# Altium project Spectre-Spectrum-Analyer.PrjPcb
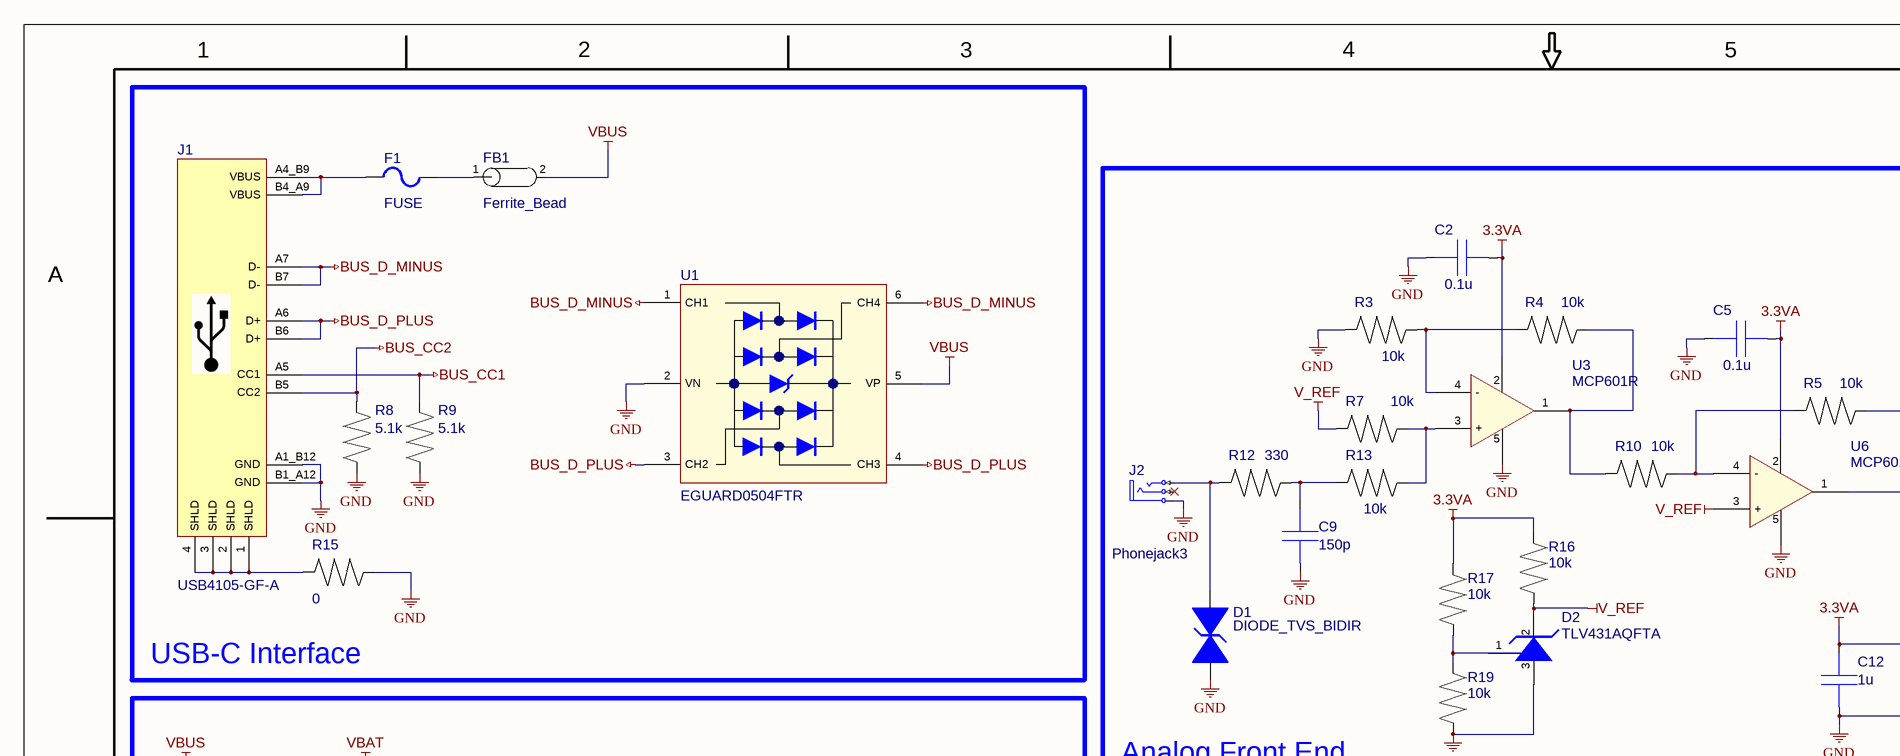
[diagram p0: Spectre-SCH_SH2_(rev).SchDoc, top left]
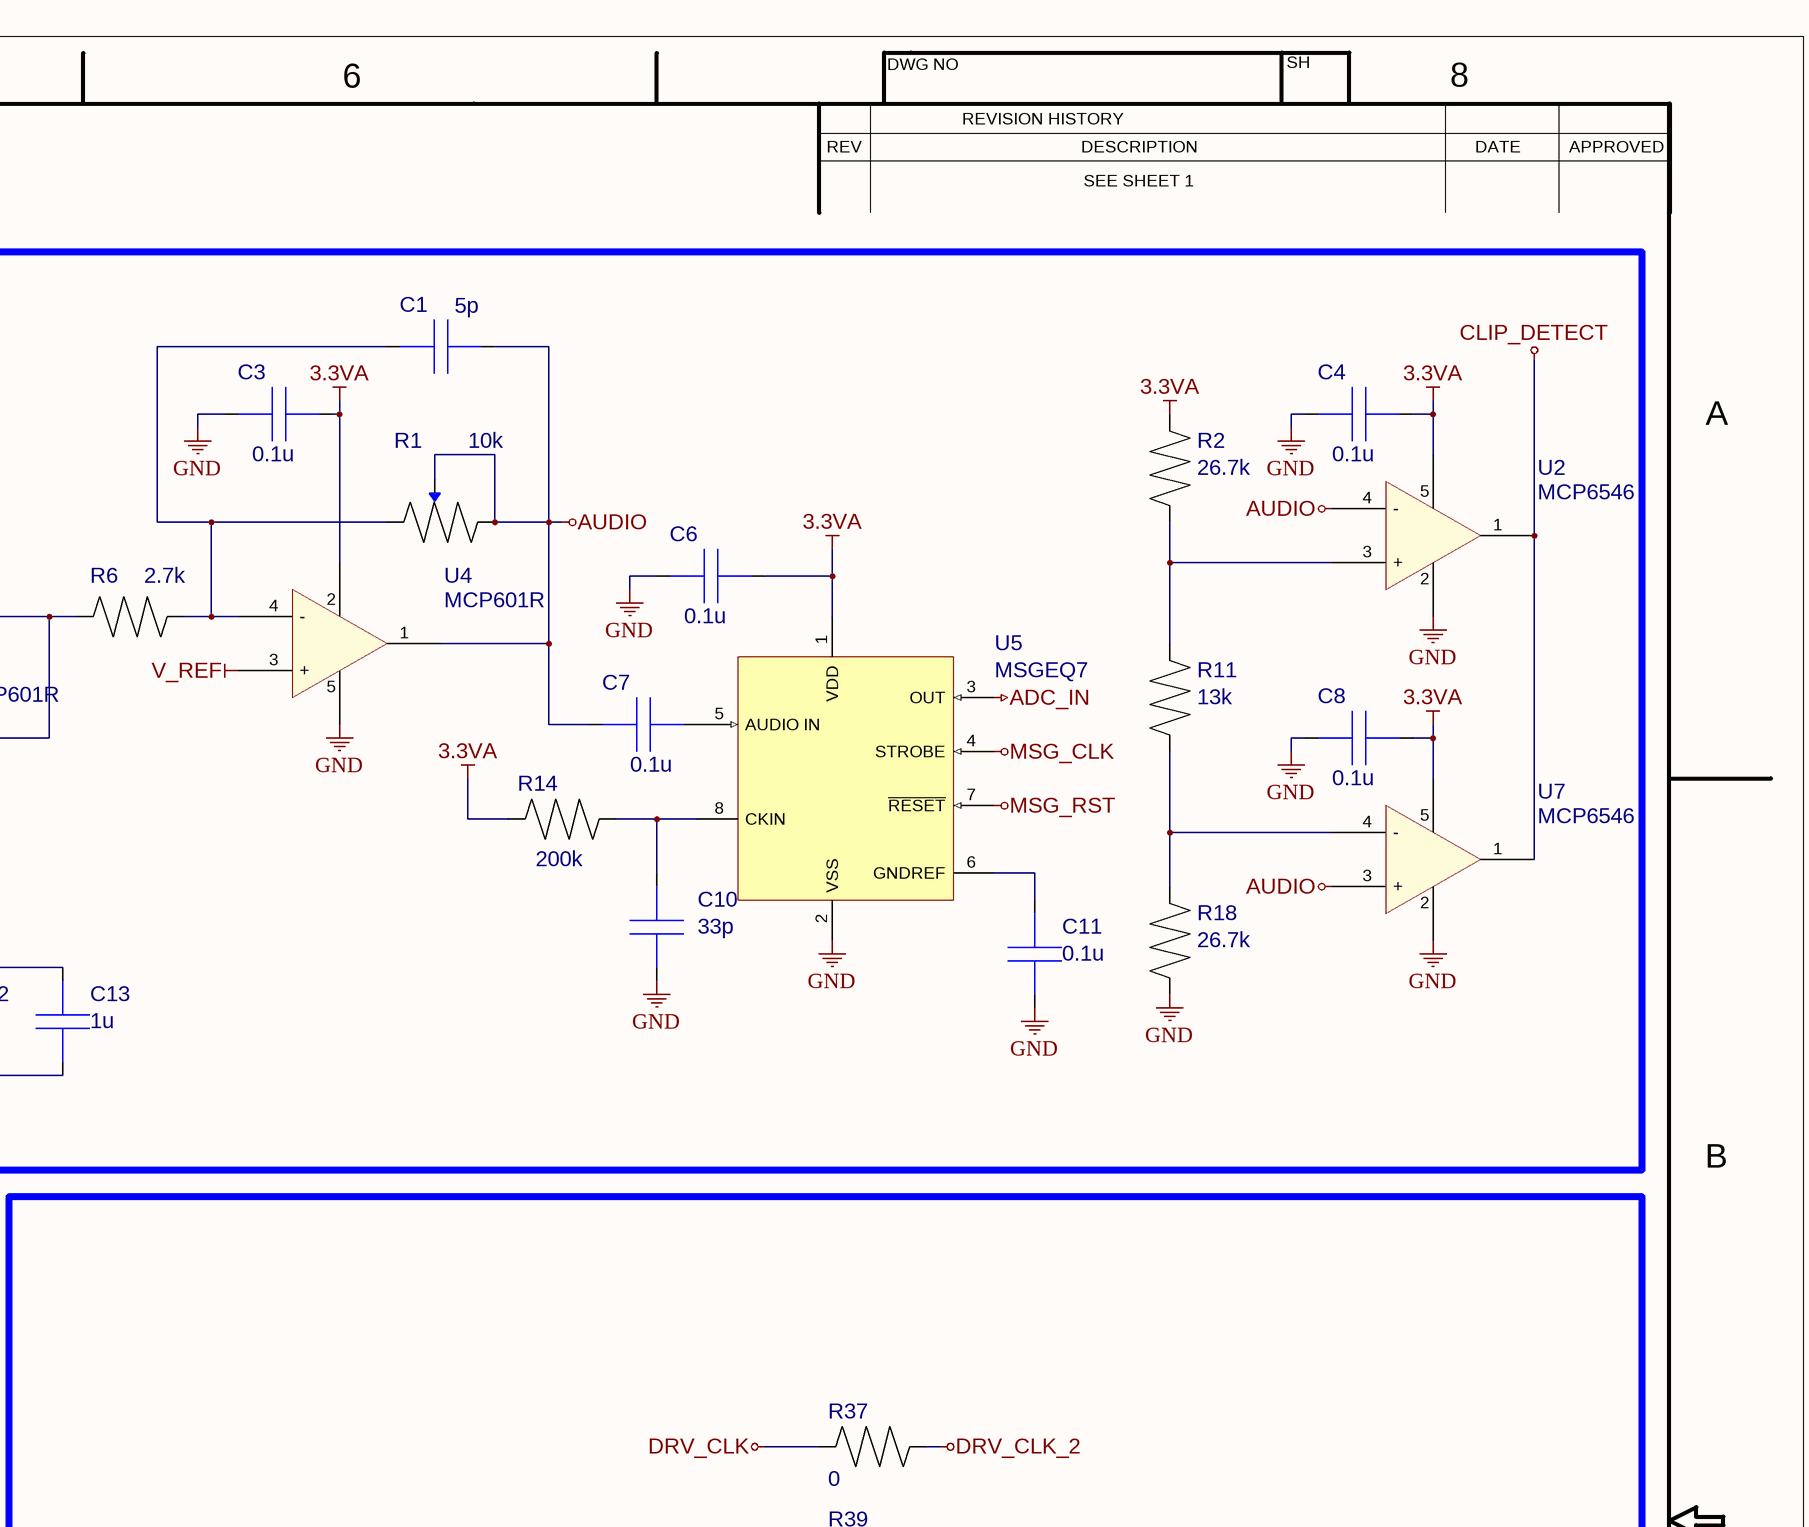
[diagram p1: Spectre-SCH_SH2_(rev).SchDoc, top right]
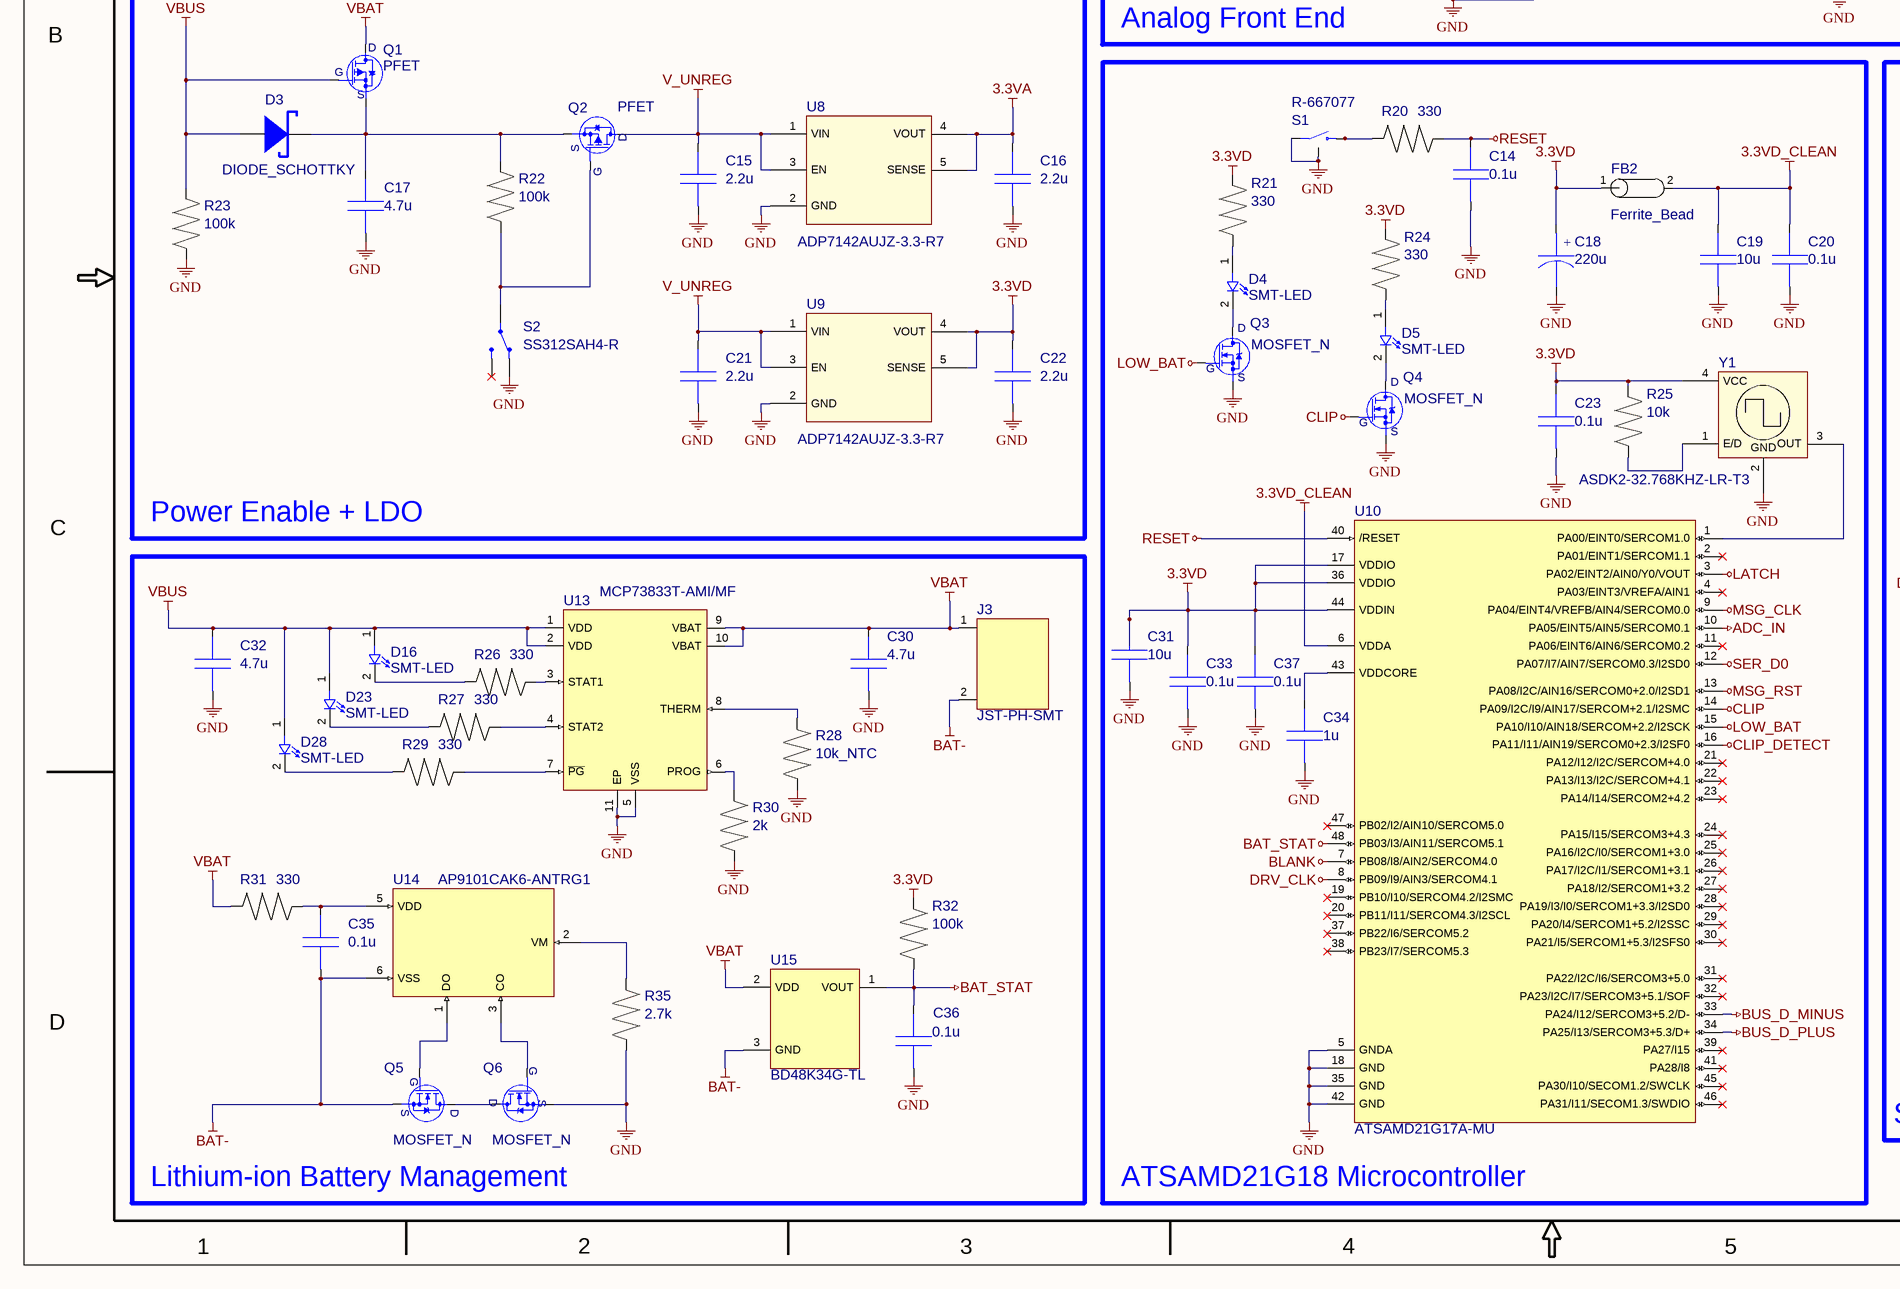
[diagram p2: Spectre-SCH_SH2_(rev).SchDoc, bottom left]
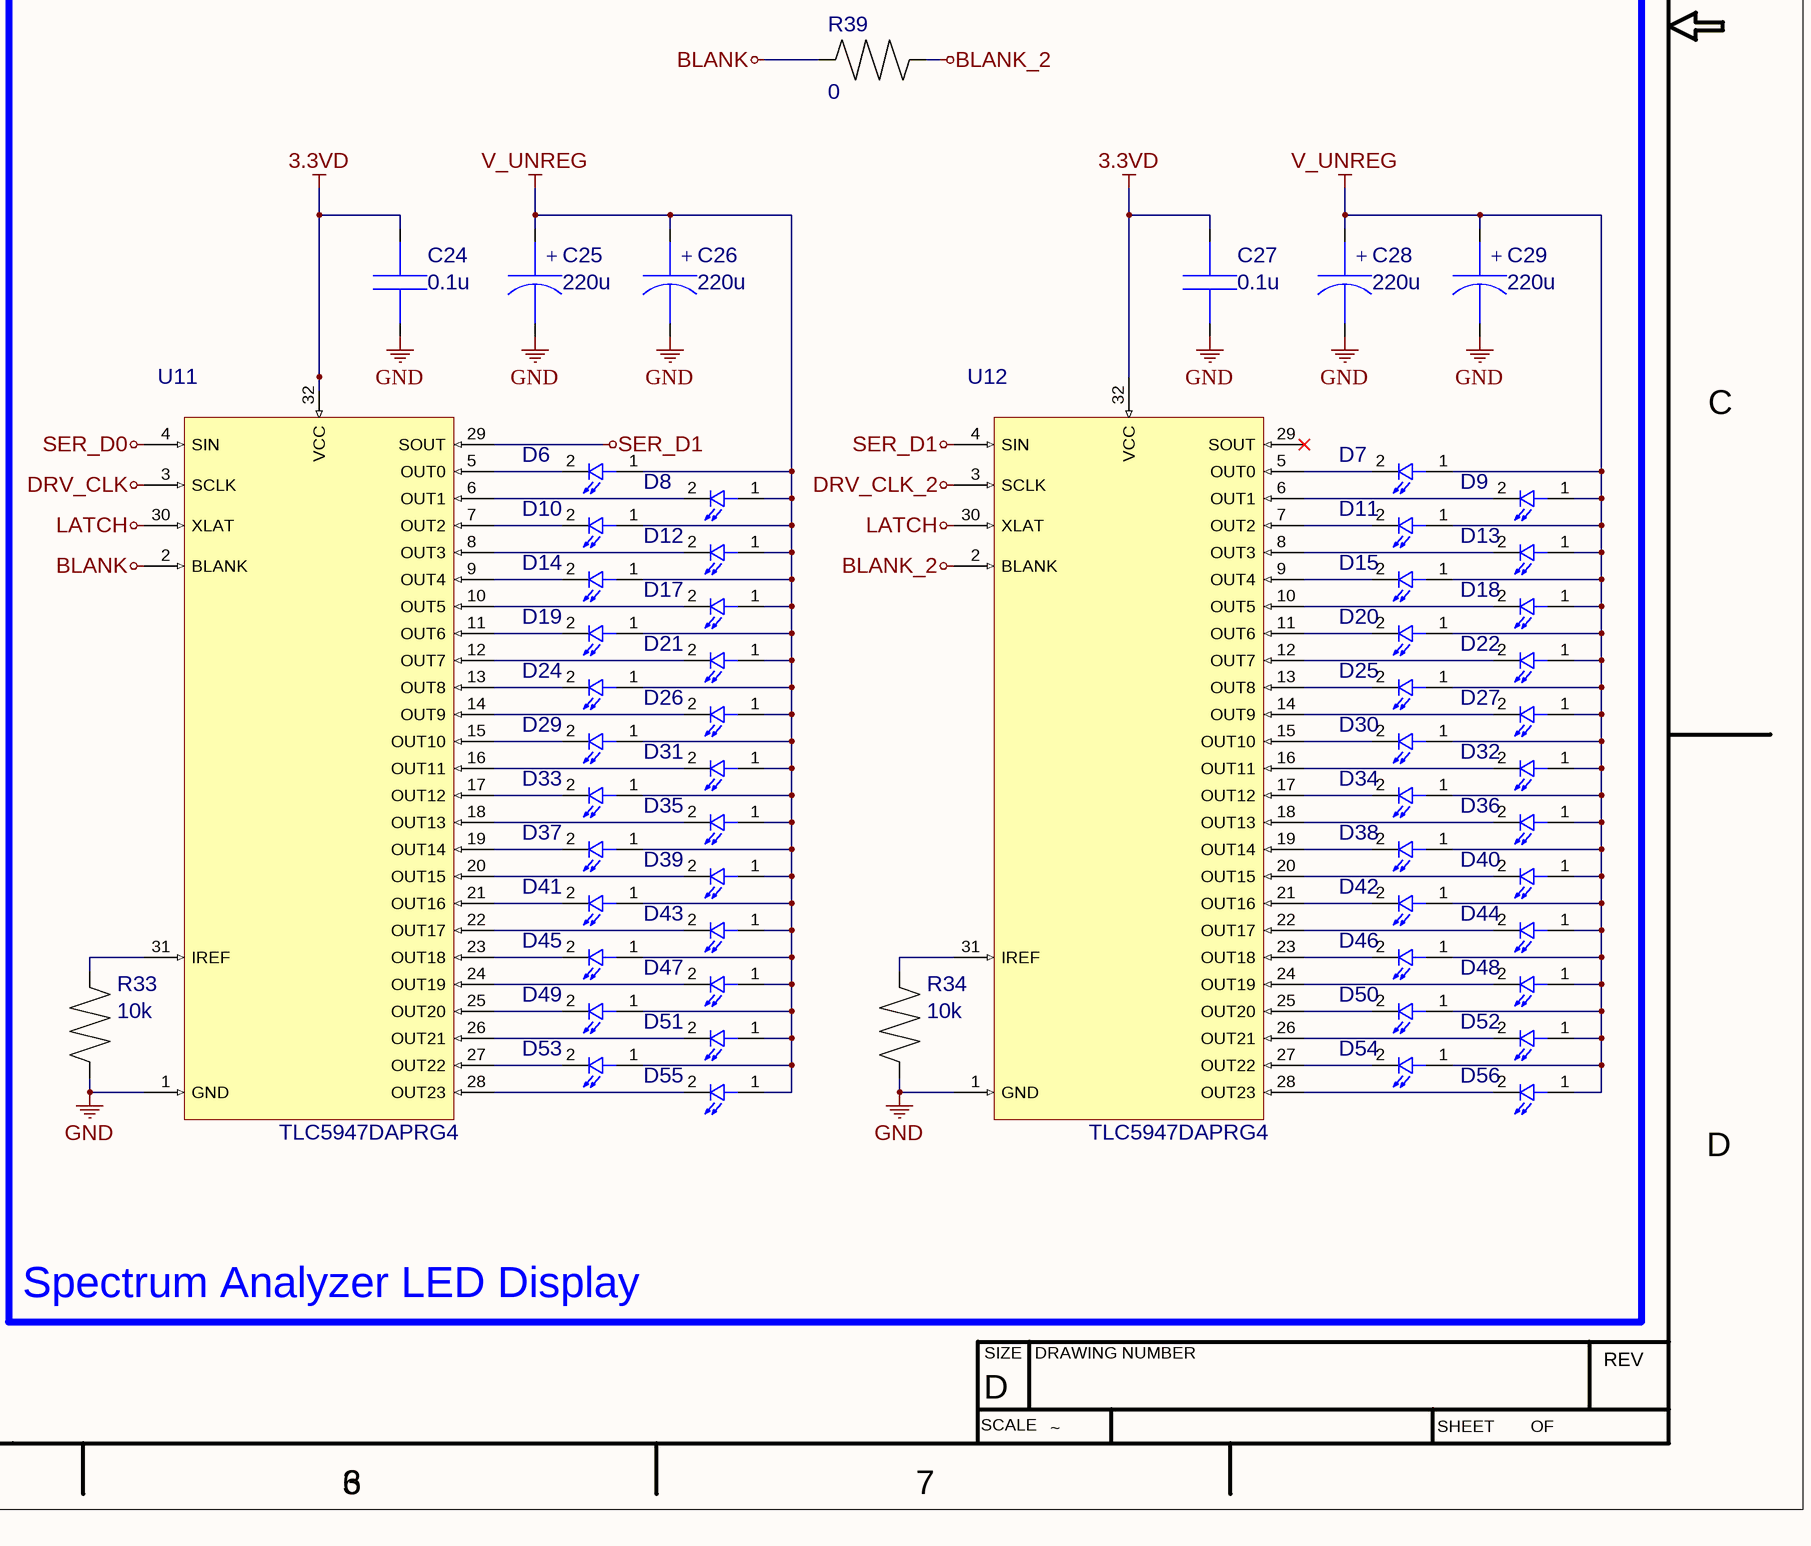
[diagram p3: Spectre-SCH_SH2_(rev).SchDoc, bottom right]
Company: OCEAN INSIGHT; DateDftg: -; DateEng: 09/10/21; DocNumber: Spectre; DocNumberPCB: SpectrePCB; Hist1Appr: -; Hist1Date: -; Hist1Desc: -; Hist1Rev: -; Hist2Appr: -; Hist2Date: -; Hist2Desc: -; Hist2Rev: -; Hist3Appr: -; Hist3Date: -; Hist3Desc: -; Hist3Rev: -; NameDftg: K. KIDD; NameEng: K. KIDD; Rev: A; Title0: Spectre; Title1: Audio Spectrum Analyzer; TitleCCA: CIRCUIT CARD ASSEMBLY,; TitlePCB: PRINTED CIRCUIT BOARD,; TitleSCH: SCHEMATIC, CCA,
1 sheet, 160 parts. Net scope: global (net labels, ports and power ports of the same name join across sheets).
Board file: Spectre.PcbDoc

## Sheet Spectre-SCH_SH2_(rev).SchDoc: SCHEMATIC
size 863 x 558 mm; DocumentNumber: XXX-20XXX-XXX; SheetNumber: 2; SheetTotal: 2; PageSetup: Record=PageOptions|CenterHorizontal=True|CenterVertical=True|PrintScale=0.98|XCorrection=1.00|YCorrection=1.00|PrintKind=2|BorderSize=5000000|LeftOffset=0|BottomOffset=0|Orientation=2|PaperLength=1000|PaperWidth=1000|Scale=100|PaperSource=15|PrintQuality=1200|MediaType=1|DitherType=10|PaperKind=11 x 17|PrintScaleMode=1

### Parts
C1  5p  [0805]
C2  0.1u  [0805]
C3  0.1u  [0805]
C4  0.1u  [0805]
C5  0.1u  [0805]
C6  0.1u  [0805]
C7  0.1u  [0805]
C8  0.1u  [0805]
C9  150p  [0805]
C10  33p  [0805]
C11  0.1u  [0805]
C12  1u  [0805]
C13  1u  [0805]
C14  0.1u  [0805]
C15  2.2u  [0805]
C16  2.2u  [0805]
C17  4.7u  [0603]
C18  220u  [D]
C19  10u  [0805]
C20  0.1u  [0805]
C21  2.2u  [0805]
C22  2.2u  [0805]
C23  0.1u  [0805]
C24  0.1u  [0805]
C25  220u  [D]
C26  220u  [D]
C27  0.1u  [0805]
C28  220u  [D]
C29  220u  [D]
C30  4.7u  [0603]
C31  10u  [1206]
C32  4.7u  [0603]
C33  0.1u  [0805]
C34  1u  [0805]
C35  0.1u  [0805]
C36  0.1u  [0805]
C37  0.1u  [0805]
D1  DIODE_TVS_BIDIR  [0603]
D2  TLV431AQFTA  [SOT-23-3]
D3  DIODE_SCHOTTKY  [SMA]
D4  SMT-LED  [0805 LED]
D5  SMT-LED  [0805 LED]
D6  SMT-LED  [0805 LED]  (value not drawn)
D7  SMT-LED  [0805 LED]  (value not drawn)
D8  SMT-LED  [0805 LED]  (value not drawn)
D9  SMT-LED  [0805 LED]  (value not drawn)
D10  SMT-LED  [0805 LED]  (value not drawn)
D11  SMT-LED  [0805 LED]  (value not drawn)
D12  SMT-LED  [0805 LED]  (value not drawn)
D13  SMT-LED  [0805 LED]  (value not drawn)
D14  SMT-LED  [0805 LED]  (value not drawn)
D15  SMT-LED  [0805 LED]  (value not drawn)
D16  SMT-LED  [0805 LED]
D17  SMT-LED  [0805 LED]  (value not drawn)
D18  SMT-LED  [0805 LED]  (value not drawn)
D19  SMT-LED  [0805 LED]  (value not drawn)
D20  SMT-LED  [0805 LED]  (value not drawn)
D21  SMT-LED  [0805 LED]  (value not drawn)
D22  SMT-LED  [0805 LED]  (value not drawn)
D23  SMT-LED  [0805 LED]
D24  SMT-LED  [0805 LED]  (value not drawn)
D25  SMT-LED  [0805 LED]  (value not drawn)
D26  SMT-LED  [0805 LED]  (value not drawn)
D27  SMT-LED  [0805 LED]  (value not drawn)
D28  SMT-LED  [0805 LED]
D29  SMT-LED  [0805 LED]  (value not drawn)
D30  SMT-LED  [0805 LED]  (value not drawn)
D31  SMT-LED  [0805 LED]  (value not drawn)
D32  SMT-LED  [0805 LED]  (value not drawn)
D33  SMT-LED  [0805 LED]  (value not drawn)
D34  SMT-LED  [0805 LED]  (value not drawn)
D35  SMT-LED  [0805 LED]  (value not drawn)
D36  SMT-LED  [0805 LED]  (value not drawn)
D37  SMT-LED  [0805 LED]  (value not drawn)
D38  SMT-LED  [0805 LED]  (value not drawn)
D39  SMT-LED  [0805 LED]  (value not drawn)
D40  SMT-LED  [0805 LED]  (value not drawn)
D41  SMT-LED  [0805 LED]  (value not drawn)
D42  SMT-LED  [0805 LED]  (value not drawn)
D43  SMT-LED  [0805 LED]  (value not drawn)
D44  SMT-LED  [0805 LED]  (value not drawn)
D45  SMT-LED  [0805 LED]  (value not drawn)
D46  SMT-LED  [0805 LED]  (value not drawn)
D47  SMT-LED  [0805 LED]  (value not drawn)
D48  SMT-LED  [0805 LED]  (value not drawn)
D49  SMT-LED  [0805 LED]  (value not drawn)
D50  SMT-LED  [0805 LED]  (value not drawn)
D51  SMT-LED  [0805 LED]  (value not drawn)
D52  SMT-LED  [0805 LED]  (value not drawn)
D53  SMT-LED  [0805 LED]  (value not drawn)
D54  SMT-LED  [0805 LED]  (value not drawn)
D55  SMT-LED  [0805 LED]  (value not drawn)
D56  SMT-LED  [0805 LED]  (value not drawn)
F1  FUSE  [1206]
FB1  Ferrite_Bead  [0805]
FB2  Ferrite_Bead  [0805]
J1  USB4105-GF-A  [USB4105-GF-A]
J2  Phonejack3  [STX-3500-3NTR]
J3  JST-PH-SMT  [JST-PH-SMT]
Q1  PFET  [TO-252-3]
Q2  PFET  [TO-252-3]
Q3  MOSFET_N  [SOT-23]
Q4  MOSFET_N  [SOT-23]
Q5  MOSFET_N  [SOT-23]
Q6  MOSFET_N  [SOT-23]
R1  10k  [Adafruit 356]
R2  26.7k  [0805]
R3  10k  [0805]
R4  10k  [0805]
R5  10k  [0805]
R6  2.7k  [0805]
R7  10k  [0805]
R8  5.1k  [0805]
R9  5.1k  [0805]
R10  10k  [0805]
R11  13k  [0805]
R12  330  [0805]
R13  10k  [0805]
R14  200k  [0805]
R15  0  [0805]
R16  10k  [0805]
R17  10k  [0805]
R18  26.7k  [0805]
R19  10k  [0805]
R20  330  [0805]
R21  330  [0805]
R22  100k  [0805]
R23  100k  [0805]
R24  330  [0805]
R25  10k  [0805]
R26  330  [0805]
R27  330  [0805]
R28  10k_NTC  [0805]
R29  330  [0805]
R30  2k  [0805]
R31  330  [0805]
R32  100k  [0805]
R33  10k  [0805]
R34  10k  [0805]
R35  2.7k  [0805]
R37  0  [0805]
R39  0  [0805]
S1  R-667077  [R-667077]
S2  SS312SAH4-R  [SW_SS312SAH4-R]
U1  EGUARD0504FTR  [TSOP65P120X90-6N]
U2  MCP6546  [PCBComponent_1]
U3  MCP601R  [PCBComponent_1]
U4  MCP601R  [PCBComponent_1]
U5  MSGEQ7  [MSGEQ7]
U6  MCP601R  [PCBComponent_1]
U7  MCP6546  [PCBComponent_1]
U8  ADP7142AUJZ-3.3-R7  [TSOT-23-5]
U9  ADP7142AUJZ-3.3-R7  [TSOT-23-5]
U10  ATSAMD21G17A-MU  [ATSAMD21G17A-MU]
U11  TLC5947DAPRG4  [*SOP65P810X120-32N]
U12  TLC5947DAPRG4  [*SOP65P810X120-32N]
U13  MCP73833T-AMI/MF  [PCBComponent_1]
U14  AP9101CAK6-ANTRG1  [SOT-25]
U15  BD48K34G-TL  [SOT-23-3]
Y1  ASDK2-32.768KHZ-LR-T3  [ASDK2-32.768KHZ-LR-T3]

### Blocks framed on the sheet
USB-C Interface: F1 FB1 J1 R8 R9 R15 U1
Analog Front End: C1-C13 D1 D2 J2 R1-R7 R10-R14 R16-R19 U2-U7
Power Enable + LDO: C15-C17 C21 C22 D3 Q1 Q2 R22 R23 S2 U8 U9
ATSAMD21G18 Microcontroller: C14 C18-C20 C23 C31 C33 C34 C37 D4 D5 FB2 Q3 Q4 R20 R21 R24 R25 S1 U10 Y1
Spectrum Analyzer LED Display: C24-C29 D6-D15 D17-D22 D24-D27 D29-D56 R33 R34 R37 R39 U11 U12
Lithium-ion Battery Management: C30 C32 C35 C36 D16 D23 D28 J3 Q5 Q6 R26-R32 R35 U13-U15

### Nets
3.3VA: C2.1 C3.1 C4.1 C5.1 C6.1 C8.1 C12.2 C13.2 C16.2 R2.2 R14.2 R16.1 R17.1 U2.5(V+) U3.2(V+) U4.2(V+) U5.1(VDD) U6.2(V+) U7.5(V+) U8.4(VOUT) U8.5(SENSE)
3.3VD: C18.1 C22.2 C23.2 C24.2 C27.2 C31.2 C33.2 C37.2 FB2.1 R21.2 R24.2 R25.2 R32.1 U9.4(VOUT) U9.5(SENSE) U10.17(VDDIO) U10.36(VDDIO) U10.44(VDDIN) U11.32(VCC) U12.32(VCC) Y1.4(VCC)
3.3VD_CLEAN: C19.2 C20.2 FB2.2 U10.6(VDDA)
ADC_IN: U5.3(OUT) U10.10(PA05/EINT5/AIN5/SERCOM0.1)
AUDIO: C1.1 C7.2 R1.2 R1.3 U2.4(-) U4.1(OUT) U7.3(+)
BAT-: C35.1 J3.2 Q5.3(S) U14.6(VSS) U15.3(GND)
BAT_STAT: C36.2 R32.2 U10.48(PB03/I3/AIN11/SERCOM5.1) U15.1(VOUT)
BLANK: R39.2 U10.7(PB08/I8/AIN2/SERCOM4.0) U11.2(BLANK)
BLANK_2: R39.1 U12.2(BLANK)
BUS_CC1: J1.A5(CC1) R9.2
BUS_CC2: J1.B5(CC2) R8.2
BUS_D_MINUS: J1.A7(D-) J1.B7(D-) U1.1(CH1) U1.6(CH4) U10.33(PA24/I12/SERCOM3+5.2/D-)
BUS_D_PLUS: J1.A6(D+) J1.B6(D+) U1.3(CH2) U1.4(CH3) U10.34(PA25/I13/SERCOM3+5.3/D+)
CLIP: Q4.1(G) U10.14(PA09/I2C/I9/AIN17/SERCOM+2.1/I2SMC)
CLIP_DETECT: U2.1(OUT) U7.1(OUT) U10.16(PA11/I11/AIN19/SERCOM0+2.3/I2SF0)
DRV_CLK: R37.2 U10.8(PB09/I9/AIN3/SERCOM4.1) U11.3(SCLK)
DRV_CLK_2: R37.1 U12.3(SCLK)
GND: C2.2 C3.2 C4.2 C5.2 C6.2 C8.2 C9.1 C10.2 C11.2 C12.1 C13.1 C14.1 C15.1 C16.1 C17.1 C18.2 C19.1 C20.1 C21.1 C22.1 C23.1 C24.1 C25.2 C26.2 C27.1 C28.2 C29.2 C30.1 C31.1 C32.1 C33.1 C34.1 C36.1 C37.1 D1.1 D2.3(A) J1.A1_B12(GND) J1.B1_A12(GND) J2.1(S) Q3.3(S) Q4.3(S) Q6.3(S) R3.2 R8.1 R9.1 R15.1 R18.1 R19.2 R23.1 R28.2 R30.2 R33.1 R34.1 R35.2 S1.1(GND) S1.2(NO) S2.1 U1.2(VN) U2.2(V-) U3.5(V-) U4.5(V-) U5.2(VSS) U6.5(V-) U7.2(V-) U8.2(GND) U9.2(GND) U10.5(GNDA) U10.18(GND) U10.35(GND) U10.42(GND) U11.1(GND) U12.1(GND) U13.5(VSS) U13.11(EP) Y1.2(GND)
LATCH: U10.3(PA02/EINT2/AIN0/Y0/VOUT) U11.30(XLAT) U12.30(XLAT)
LOW_BAT: Q3.1(G) U10.15(PA10/I10/AIN18/SERCOM+2.2/I2SCK)
MSG_CLK: U5.4(STROBE) U10.9(PA04/EINT4/VREFB/AIN4/SERCOM0.0)
MSG_RST: U5.7(~{RESET}) U10.13(PA08/I2C/AIN16/SERCOM0+2.0/I2SD1)
RESET: C14.2 R20.1 U10.40(/RESET)
SER_D0: U10.12(PA07/I7/AIN7/SERCOM0.3/I2SD0) U11.4(SIN)
SER_D1: U11.29(SOUT) U12.4(SIN)
V_REF: D2.2(K) R7.2 R16.2 U4.3(+) U6.3(+)
V_UNREG: C15.2 C21.2 C25.1 C26.1 C28.1 C29.1 D6.1 D7.1 D8.1 D9.1 D10.1 D11.1 D12.1 D13.1 D14.1 D15.1 D17.1 D18.1 D19.1 D20.1 D21.1 D22.1 D24.1 D25.1 D26.1 D27.1 D29.1 D30.1 D31.1 D32.1 D33.1 D34.1 D35.1 D36.1 D37.1 D38.1 D39.1 D40.1 D41.1 D42.1 D43.1 D44.1 D45.1 D46.1 D47.1 D48.1 D49.1 D50.1 D51.1 D52.1 D53.1 D54.1 D55.1 D56.1 Q2.2(D) U8.1(VIN) U8.3(EN) U9.1(VIN) U9.3(EN)
VBAT: C30.2 J3.1 Q1.2(D) R31.2 U13.9(VBAT) U13.10(VBAT) U15.2(VDD)
VBUS: C32.2 D3.1(A) D16.1 D23.1 D28.1 FB1.2 Q1.1(G) R23.2 U1.5(VP) U13.1(VDD) U13.2(VDD)
NetC1_2: C1.2 R1.1 R6.1 U4.4(-)
NetC7_1: C7.1 U5.5(AUDIO_IN)
NetC9_2: C9.2 R12.1 R13.2
NetC10_1: C10.1 R14.1 U5.8(CKIN)
NetC11_1: C11.1 U5.6(GNDREF)
NetC17_2: C17.2 D3.2(K) Q1.3(S) Q2.3(S) R22.2
NetC34_2: C34.2 U10.43(VDDCORE)
NetC35_2: C35.2 R31.1 U14.5(VDD)
NetD1_2: D1.2 J2.3(T) R12.2
NetD2_1: D2.1(REF) R17.2 R19.1
NetD4_1: D4.1 R21.1
NetD4_2: D4.2 Q3.2(D)
NetD5_1: D5.1 R24.1
NetD5_2: D5.2 Q4.2(D)
NetD6_2: D6.2 U11.5(OUT0)
NetD7_2: D7.2 U12.5(OUT0)
NetD8_2: D8.2 U11.6(OUT1)
NetD9_2: D9.2 U12.6(OUT1)
NetD10_2: D10.2 U11.7(OUT2)
NetD11_2: D11.2 U12.7(OUT2)
NetD12_2: D12.2 U11.8(OUT3)
NetD13_2: D13.2 U12.8(OUT3)
NetD14_2: D14.2 U11.9(OUT4)
NetD15_2: D15.2 U12.9(OUT4)
NetD16_2: D16.2 R26.2
NetD17_2: D17.2 U11.10(OUT5)
NetD18_2: D18.2 U12.10(OUT5)
NetD19_2: D19.2 U11.11(OUT6)
NetD20_2: D20.2 U12.11(OUT6)
NetD21_2: D21.2 U11.12(OUT7)
NetD22_2: D22.2 U12.12(OUT7)
NetD23_2: D23.2 R27.2
NetD24_2: D24.2 U11.13(OUT8)
NetD25_2: D25.2 U12.13(OUT8)
NetD26_2: D26.2 U11.14(OUT9)
NetD27_2: D27.2 U12.14(OUT9)
NetD28_2: D28.2 R29.2
NetD29_2: D29.2 U11.15(OUT10)
NetD30_2: D30.2 U12.15(OUT10)
NetD31_2: D31.2 U11.16(OUT11)
NetD32_2: D32.2 U12.16(OUT11)
NetD33_2: D33.2 U11.17(OUT12)
NetD34_2: D34.2 U12.17(OUT12)
NetD35_2: D35.2 U11.18(OUT13)
NetD36_2: D36.2 U12.18(OUT13)
NetD37_2: D37.2 U11.19(OUT14)
NetD38_2: D38.2 U12.19(OUT14)
NetD39_2: D39.2 U11.20(OUT15)
NetD40_2: D40.2 U12.20(OUT15)
NetD41_2: D41.2 U11.21(OUT16)
NetD42_2: D42.2 U12.21(OUT16)
NetD43_2: D43.2 U11.22(OUT17)
NetD44_2: D44.2 U12.22(OUT17)
NetD45_2: D45.2 U11.23(OUT18)
NetD46_2: D46.2 U12.23(OUT18)
NetD47_2: D47.2 U11.24(OUT19)
NetD48_2: D48.2 U12.24(OUT19)
NetD49_2: D49.2 U11.25(OUT20)
NetD50_2: D50.2 U12.25(OUT20)
NetD51_2: D51.2 U11.26(OUT21)
NetD52_2: D52.2 U12.26(OUT21)
NetD53_2: D53.2 U11.27(OUT22)
NetD54_2: D54.2 U12.27(OUT22)
NetD55_2: D55.2 U11.28(OUT23)
NetD56_2: D56.2 U12.28(OUT23)
NetF1_1: F1.1 J1.A4_B9(VBUS) J1.B4_A9(VBUS)
NetF1_2: F1.2 FB1.1
NetJ1_1: J1.1(SHLD) J1.2(SHLD) J1.3(SHLD) J1.4(SHLD) R15.2
NetQ2_1: Q2.1(G) R22.1 S2.2
NetQ5_1: Q5.1(G) U14.1(DO)
NetQ5_2: Q5.2(D) Q6.2(D)
NetQ6_1: Q6.1(G) U14.3(CO)
NetR2_1: R2.1 R11.2 U2.3(+)
NetR3_1: R3.1 R4.2 U3.4(-)
NetR4_1: R4.1 R10.2 U3.1(OUT)
NetR5_1: R5.1 R6.2 U6.1(OUT)
NetR5_2: R5.2 R10.1 U6.4(-)
NetR7_1: R7.1 R13.1 U3.3(+)
NetR11_1: R11.1 R18.2 U7.4(-)
NetR20_2: R20.2 S1.3(COM) S1.4(COM) S1.5(COM)
NetR25_1: R25.1 Y1.1(E/D)
NetR26_1: R26.1 U13.3(STAT1)
NetR27_1: R27.1 U13.4(STAT2)
NetR28_1: R28.1 U13.8(THERM)
NetR29_1: R29.1 U13.7(~{PG})
NetR30_1: R30.1 U13.6(PROG)
NetR33_2: R33.2 U11.31(IREF)
NetR34_2: R34.2 U12.31(IREF)
NetR35_1: R35.1 U14.2(VM)
NetU10_1: U10.1(PA00/EINT0/SERCOM1.0) Y1.3(OUT)

Not connected (* = marked no-connect by the designer): J2 2(R)*; S2 3*; U10 2(PA01/EINT1/SERCOM1.1)* 4(PA03/EINT3/VREFA/AIN1)* 11(PA06/EINT6/AIN6/SERCOM0.2)* 19(PB10/I10/SERCOM4.2/I2SMC)* 20(PB11/I11/SERCOM4.3/I2SCL)* 21(PA12/I12/I2C/SERCOM+4.0)* 22(PA13/I13/I2C/SERCOM+4.1)* 23(PA14/I14/SERCOM2+4.2)* 24(PA15/I15/SERCOM3+4.3)* 25(PA16/I2C/I0/SERCOM1+3.0)* 26(PA17/I2C/I1/SERCOM1+3.1)* 27(PA18/I2/SERCOM1+3.2)* 28(PA19/I3/I0/SERCOM1+3.3/I2SD0)* 29(PA20/I4/SERCOM1+5.2/I2SSC)* 30(PA21/I5/SERCOM1+5.3/I2SFS0)* 31(PA22/I2C/I6/SERCOM3+5.0)* 32(PA23/I2C/I7/SERCOM3+5.1/SOF)* 37(PB22/I6/SERCOM5.2)* 38(PB23/I7/SERCOM5.3)* 39(PA27/I15)* 41(PA28/I8)* 45(PA30/I10/SECOM1.2/SWCLK)* 46(PA31/I11/SECOM1.3/SWDIO)* 47(PB02/I2/AIN10/SERCOM5.0)*; U12 29(SOUT)*

### Notes on the sheet
- 1
- 2
- 3
- 4
- 5
- 6
- DWG NO
- REVISION HISTORY
- SH
- 8
- REV
- DESCRIPTION
- SEE SHEET 1
- DATE
- APPROVED
- A
- B
- C
- D
- SIZE
- DRAWING NUMBER
- SCALE
- ~
- SHEET        OF
- 7
- (in symbol CAP_POL) +

### Library data of the parts
C1-C17 C19-C24 C27 C30-C37 = CAP: Part Number: *; Manufacturer: *
C18 C25 C26 C28 C29 = CAP_POL: CAP TANT POLY 220UF 6.3V 2917; Manufacturer: KEMET; Part Number: T525D227M006ATE025
D1 = DIODE_TVS_BIDIR: TVS DIODE BIDIR; Manufacturer: *; Part Number: *
D2 = TLV431AQFTA: Shunt Voltage Reference IC Adjustable 1.24V 18 VV ±1% 15 mA SOT-23-3; Manufacturer: Diodes Incorporated; Part Number: TLV431AQFTA
D3 = DIODE_SCHOTTKY: DIODE SCHOTTKY; Manufacturer: *; Part Number: *
FB1 FB2 = Ferrite_Bead: Ferrite Bead; Manufacturer: *; Part Number: *
J1 = USB4105-GF-A: USB-C (USB TYPE-C) USB 2.0 Receptacle Connector 24 (16+8 Dummy) Position Surface Mount, Right Angle; Through Hole; Manufacturer: GCT; Part Number: USB4105-GF-A
J2 = Phonejack3: Jack Socket, 1/4" [6.5mm], Thru-Hole, Vertical, 3-Conductor Open Circuit (Non-Normalling); PackageDocument: 2003; PCB_Layout: Complies with manufacturer's recommendation.; DrillAndSlotSize: Corresponds to nominal value.; Published: 15-Jul-2004; LatestRevisionDate: 15-Jul-2004; LatestRevisionNote: Component Replaced.; DatasheetDocument: 2003; PackageReference: S1VS_SSS; Publisher: Altium Limited; ComponentLink1Description: Manufacturer Link; ComponentLink1URL: http://www.cliffuk.co.uk/
Q1 Q2 = MOSFET_P: MOSFET, P CH, 3-PIN; Manufacturer: *; Part Number: *
Q3-Q6 = MOSFET_N: MOSFET, N CH, 3-PIN; Part Number: *; Manufacturer: *
R1 = Adafruit 356: 10 kOhms - PC Pin Through Hole Trimmer Potentiometer - Turn Top Adjustment; Manufacturer: Adafruit Industries LLC; Part Number: 356
R2-R35 R37 R39 = RES: RESISTOR; Part Number: *; Manufacturer: *
S1 = R-667077: Tactile Switch SPST-NO Top Actuated Surface Mount; Manufacturer: Mitsumi Electric Company Ltd; Part Number: R-667077
S2 = SS312SAH4-R: Slide Switch SPDT Surface Mount, Right Angle; Manufacturer: NKK Switches; Part Number: SS312SAH4-R
U13 = MCP73833T-AMI/MF: Charger IC Lithium Ion/Polymer 10-DFN _3x3_; MF: Microchip; MP: MCP73833T-AMI/MF; Availability: Unavailable; SnapEDA_Link: https://www.snapeda.com/parts/MCP73833T-AMI/MF/Microchip/view-part/1192592/?ref=snap; Package: DFN-10 Microchip; Price: None; Value: *
U14 = AP9101CAK6-ANTRG1: Ic Batt Prot Li-Ion 1-Cell Sot26; Package: None; Price: None; Value: *; MP: AP9101CAK6-ANTRG1; Availability: Unavailable
U15 = BD48K34G-TL: Supervisor Open Drain or Open Collector 1 Channel 3-SSOP
F1 = FUSE: Part Number: *; Manufacturer: *
U11 U12 = TLC5947DAPRG4: Value: *